# EAGLE design CurrentSensorAC712-30_multi (EAGLE 9.6.2)
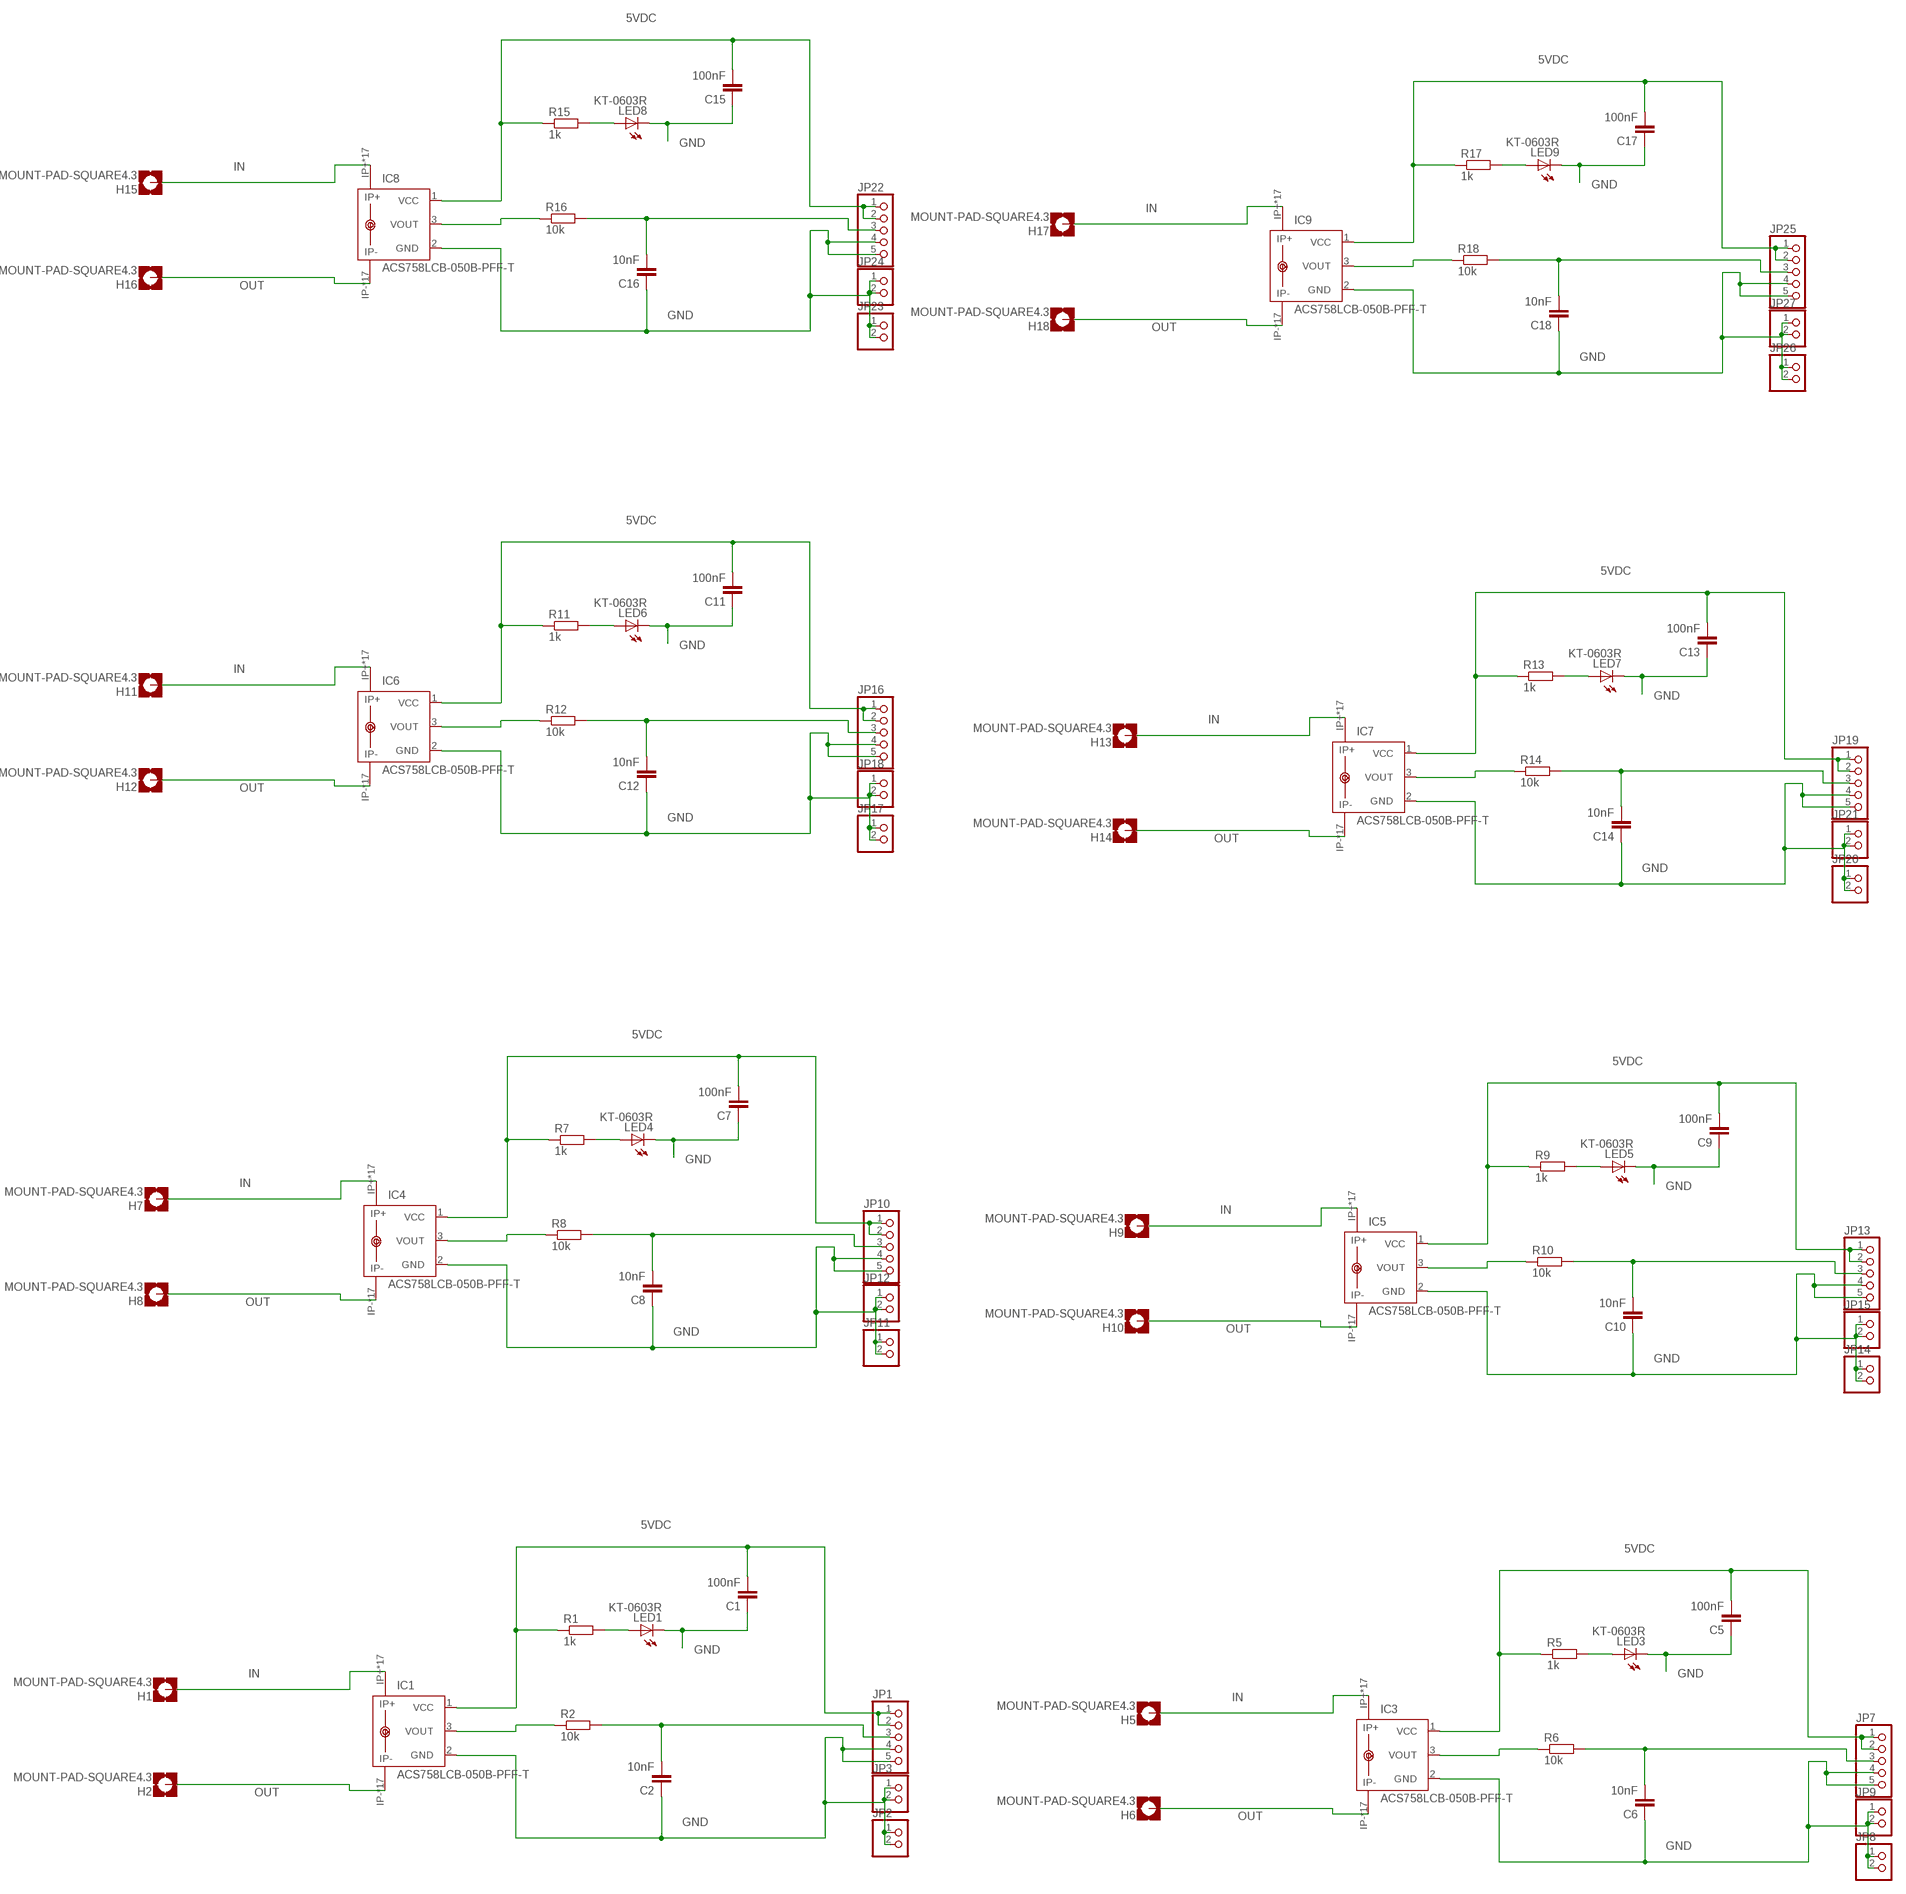
[diagram p0: schematic, sheet 1]

## Parts
C1  100nF  C-EUC0805  [C0805]
C2  10nF  C-EUC0805  [C0805]
C5  100nF  C-EUC0805  [C0805]
C6  10nF  C-EUC0805  [C0805]
C7  100nF  C-EUC0805  [C0805]
C8  10nF  C-EUC0805  [C0805]
C9  100nF  C-EUC0805  [C0805]
C10  10nF  C-EUC0805  [C0805]
C11  100nF  C-EUC0805  [C0805]
C12  10nF  C-EUC0805  [C0805]
C13  100nF  C-EUC0805  [C0805]
C14  10nF  C-EUC0805  [C0805]
C15  100nF  C-EUC0805  [C0805]
C16  10nF  C-EUC0805  [C0805]
C17  100nF  C-EUC0805  [C0805]
C18  10nF  C-EUC0805  [C0805]
H1  MOUNT-PAD-SQUARE4.3  [4,3-PAD-SQUARE]
H2  MOUNT-PAD-SQUARE4.3  [4,3-PAD-SQUARE]
H5  MOUNT-PAD-SQUARE4.3  [4,3-PAD-SQUARE]
H6  MOUNT-PAD-SQUARE4.3  [4,3-PAD-SQUARE]
H7  MOUNT-PAD-SQUARE4.3  [4,3-PAD-SQUARE]
H8  MOUNT-PAD-SQUARE4.3  [4,3-PAD-SQUARE]
H9  MOUNT-PAD-SQUARE4.3  [4,3-PAD-SQUARE]
H10  MOUNT-PAD-SQUARE4.3  [4,3-PAD-SQUARE]
H11  MOUNT-PAD-SQUARE4.3  [4,3-PAD-SQUARE]
H12  MOUNT-PAD-SQUARE4.3  [4,3-PAD-SQUARE]
H13  MOUNT-PAD-SQUARE4.3  [4,3-PAD-SQUARE]
H14  MOUNT-PAD-SQUARE4.3  [4,3-PAD-SQUARE]
H15  MOUNT-PAD-SQUARE4.3  [4,3-PAD-SQUARE]
H16  MOUNT-PAD-SQUARE4.3  [4,3-PAD-SQUARE]
H17  MOUNT-PAD-SQUARE4.3  [4,3-PAD-SQUARE]
H18  MOUNT-PAD-SQUARE4.3  [4,3-PAD-SQUARE]
IC1  ACS758LCB-050B-PFF-T  [CB-PFF]
IC3  ACS758LCB-050B-PFF-T  [CB-PFF]
IC4  ACS758LCB-050B-PFF-T  [CB-PFF]
IC5  ACS758LCB-050B-PFF-T  [CB-PFF]
IC6  ACS758LCB-050B-PFF-T  [CB-PFF]
IC7  ACS758LCB-050B-PFF-T  [CB-PFF]
IC8  ACS758LCB-050B-PFF-T  [CB-PFF]
IC9  ACS758LCB-050B-PFF-T  [CB-PFF]
JP1  PINHD-1X5  [1X05]
JP2  PINHD-1X2  [1X02]
JP3  PINHD-1X2  [1X02]
JP7  PINHD-1X5  [1X05]
JP8  PINHD-1X2  [1X02]
JP9  PINHD-1X2  [1X02]
JP10  PINHD-1X5  [1X05]
JP11  PINHD-1X2  [1X02]
JP12  PINHD-1X2  [1X02]
JP13  PINHD-1X5  [1X05]
JP14  PINHD-1X2  [1X02]
JP15  PINHD-1X2  [1X02]
JP16  PINHD-1X5  [1X05]
JP17  PINHD-1X2  [1X02]
JP18  PINHD-1X2  [1X02]
JP19  PINHD-1X5  [1X05]
JP20  PINHD-1X2  [1X02]
JP21  PINHD-1X2  [1X02]
JP22  PINHD-1X5  [1X05]
JP23  PINHD-1X2  [1X02]
JP24  PINHD-1X2  [1X02]
JP25  PINHD-1X5  [1X05]
JP26  PINHD-1X2  [1X02]
JP27  PINHD-1X2  [1X02]
LED1  KT-0603R  LEDCHIPLED_0603  [CHIPLED_0603]
LED3  KT-0603R  LEDCHIPLED_0603  [CHIPLED_0603]
LED4  KT-0603R  LEDCHIPLED_0603  [CHIPLED_0603]
LED5  KT-0603R  LEDCHIPLED_0603  [CHIPLED_0603]
LED6  KT-0603R  LEDCHIPLED_0603  [CHIPLED_0603]
LED7  KT-0603R  LEDCHIPLED_0603  [CHIPLED_0603]
LED8  KT-0603R  LEDCHIPLED_0603  [CHIPLED_0603]
LED9  KT-0603R  LEDCHIPLED_0603  [CHIPLED_0603]
R1  1k  R-EU_R0805  [R0805]
R2  10k  R-EU_R0805  [R0805]
R5  1k  R-EU_R0805  [R0805]
R6  10k  R-EU_R0805  [R0805]
R7  1k  R-EU_R0805  [R0805]
R8  10k  R-EU_R0805  [R0805]
R9  1k  R-EU_R0805  [R0805]
R10  10k  R-EU_R0805  [R0805]
R11  1k  R-EU_R0805  [R0805]
R12  10k  R-EU_R0805  [R0805]
R13  1k  R-EU_R0805  [R0805]
R14  10k  R-EU_R0805  [R0805]
R15  1k  R-EU_R0805  [R0805]
R16  10k  R-EU_R0805  [R0805]
R17  1k  R-EU_R0805  [R0805]
R18  10k  R-EU_R0805  [R0805]

## Nets
5VDC: C1.2 C5.2 C7.2 C9.2 C11.2 C13.2 C15.2 C17.2 IC1.1(VCC) IC3.1(VCC) IC4.1(VCC) IC5.1(VCC) IC6.1(VCC) IC7.1(VCC) IC8.1(VCC) IC9.1(VCC) JP1.1 JP1.2 JP7.1 JP7.2 JP10.1 JP10.2 JP13.1 JP13.2 JP16.1 JP16.2 JP19.1 JP19.2 JP22.1 JP22.2 JP25.1 JP25.2 R1.1 R5.1 R7.1 R9.1 R11.1 R13.1 R15.1 R17.1
GND: C1.1 C2.1 C5.1 C6.1 C7.1 C8.1 C9.1 C10.1 C11.1 C12.1 C13.1 C14.1 C15.1 C16.1 C17.1 C18.1 IC1.2(GND) IC3.2(GND) IC4.2(GND) IC5.2(GND) IC6.2(GND) IC7.2(GND) IC8.2(GND) IC9.2(GND) JP1.4 JP1.5 JP2.1 JP2.2 JP3.1 JP3.2 JP7.4 JP7.5 JP8.1 JP8.2 JP9.1 JP9.2 JP10.4 JP10.5 JP11.1 JP11.2 JP12.1 JP12.2 JP13.4 JP13.5 JP14.1 JP14.2 JP15.1 JP15.2 JP16.4 JP16.5 JP17.1 JP17.2 JP18.1 JP18.2 JP19.4 JP19.5 JP20.1 JP20.2 JP21.1 JP21.2 JP22.4 JP22.5 JP23.1 JP23.2 JP24.1 JP24.2 JP25.4 JP25.5 JP26.1 JP26.2 JP27.1 JP27.2 LED1.C LED3.C LED4.C LED5.C LED6.C LED7.C LED8.C LED9.C
IN: H1.B4,3(MOUNT) H5.B4,3(MOUNT) H7.B4,3(MOUNT) H9.B4,3(MOUNT) H11.B4,3(MOUNT) H13.B4,3(MOUNT) H15.B4,3(MOUNT) H17.B4,3(MOUNT) IC1.IP+ IC1.IP+@2(IP+) IC1.IP+@3(IP+) IC1.IP+@4(IP+) IC1.IP+@5(IP+) IC1.IP+@6(IP+) IC1.IP+@7(IP+) IC1.IP+@8(IP+) IC1.IP+@9(IP+) IC1.IP+@10(IP+) IC1.IP+@11(IP+) IC1.IP+@12(IP+) IC1.IP+@13(IP+) IC1.IP+@14(IP+) IC1.IP+@15(IP+) IC1.IP+@16(IP+) IC1.IP+@17(IP+) IC3.IP+ IC3.IP+@2(IP+) IC3.IP+@3(IP+) IC3.IP+@4(IP+) IC3.IP+@5(IP+) IC3.IP+@6(IP+) IC3.IP+@7(IP+) IC3.IP+@8(IP+) IC3.IP+@9(IP+) IC3.IP+@10(IP+) IC3.IP+@11(IP+) IC3.IP+@12(IP+) IC3.IP+@13(IP+) IC3.IP+@14(IP+) IC3.IP+@15(IP+) IC3.IP+@16(IP+) IC3.IP+@17(IP+) IC4.IP+ IC4.IP+@2(IP+) IC4.IP+@3(IP+) IC4.IP+@4(IP+) IC4.IP+@5(IP+) IC4.IP+@6(IP+) IC4.IP+@7(IP+) IC4.IP+@8(IP+) IC4.IP+@9(IP+) IC4.IP+@10(IP+) IC4.IP+@11(IP+) IC4.IP+@12(IP+) IC4.IP+@13(IP+) IC4.IP+@14(IP+) IC4.IP+@15(IP+) IC4.IP+@16(IP+) IC4.IP+@17(IP+) IC5.IP+ IC5.IP+@2(IP+) IC5.IP+@3(IP+) IC5.IP+@4(IP+) IC5.IP+@5(IP+) IC5.IP+@6(IP+) IC5.IP+@7(IP+) IC5.IP+@8(IP+) IC5.IP+@9(IP+) IC5.IP+@10(IP+) IC5.IP+@11(IP+) IC5.IP+@12(IP+) IC5.IP+@13(IP+) IC5.IP+@14(IP+) IC5.IP+@15(IP+) IC5.IP+@16(IP+) IC5.IP+@17(IP+) IC6.IP+ IC6.IP+@2(IP+) IC6.IP+@3(IP+) IC6.IP+@4(IP+) IC6.IP+@5(IP+) IC6.IP+@6(IP+) IC6.IP+@7(IP+) IC6.IP+@8(IP+) IC6.IP+@9(IP+) IC6.IP+@10(IP+) IC6.IP+@11(IP+) IC6.IP+@12(IP+) IC6.IP+@13(IP+) IC6.IP+@14(IP+) IC6.IP+@15(IP+) IC6.IP+@16(IP+) IC6.IP+@17(IP+) IC7.IP+ IC7.IP+@2(IP+) IC7.IP+@3(IP+) IC7.IP+@4(IP+) IC7.IP+@5(IP+) IC7.IP+@6(IP+) IC7.IP+@7(IP+) IC7.IP+@8(IP+) IC7.IP+@9(IP+) IC7.IP+@10(IP+) IC7.IP+@11(IP+) IC7.IP+@12(IP+) IC7.IP+@13(IP+) IC7.IP+@14(IP+) IC7.IP+@15(IP+) IC7.IP+@16(IP+) IC7.IP+@17(IP+) IC8.IP+ IC8.IP+@2(IP+) IC8.IP+@3(IP+) IC8.IP+@4(IP+) IC8.IP+@5(IP+) IC8.IP+@6(IP+) IC8.IP+@7(IP+) IC8.IP+@8(IP+) IC8.IP+@9(IP+) IC8.IP+@10(IP+) IC8.IP+@11(IP+) IC8.IP+@12(IP+) IC8.IP+@13(IP+) IC8.IP+@14(IP+) IC8.IP+@15(IP+) IC8.IP+@16(IP+) IC8.IP+@17(IP+) IC9.IP+ IC9.IP+@2(IP+) IC9.IP+@3(IP+) IC9.IP+@4(IP+) IC9.IP+@5(IP+) IC9.IP+@6(IP+) IC9.IP+@7(IP+) IC9.IP+@8(IP+) IC9.IP+@9(IP+) IC9.IP+@10(IP+) IC9.IP+@11(IP+) IC9.IP+@12(IP+) IC9.IP+@13(IP+) IC9.IP+@14(IP+) IC9.IP+@15(IP+) IC9.IP+@16(IP+) IC9.IP+@17(IP+)
N$1: IC1.3(VOUT) R2.1
N$5: LED1.A R1.2
N$6: C2.2 JP1.3 R2.2
N$7: LED3.A R5.2
N$8: C6.2 JP7.3 R6.2
N$9: IC3.3(VOUT) R6.1
N$10: LED4.A R7.2
N$11: C8.2 JP10.3 R8.2
N$12: IC4.3(VOUT) R8.1
N$13: LED5.A R9.2
N$14: C10.2 JP13.3 R10.2
N$15: IC5.3(VOUT) R10.1
N$16: LED6.A R11.2
N$17: C12.2 JP16.3 R12.2
N$18: IC6.3(VOUT) R12.1
N$19: LED7.A R13.2
N$20: C14.2 JP19.3 R14.2
N$21: IC7.3(VOUT) R14.1
N$22: LED8.A R15.2
N$23: C16.2 JP22.3 R16.2
N$24: IC8.3(VOUT) R16.1
N$25: LED9.A R17.2
N$26: C18.2 JP25.3 R18.2
N$27: IC9.3(VOUT) R18.1
OUT: H2.B4,3(MOUNT) H6.B4,3(MOUNT) H8.B4,3(MOUNT) H10.B4,3(MOUNT) H12.B4,3(MOUNT) H14.B4,3(MOUNT) H16.B4,3(MOUNT) H18.B4,3(MOUNT) IC1.IP- IC1.IP-@2(IP-) IC1.IP-@3(IP-) IC1.IP-@4(IP-) IC1.IP-@5(IP-) IC1.IP-@6(IP-) IC1.IP-@7(IP-) IC1.IP-@8(IP-) IC1.IP-@9(IP-) IC1.IP-@10(IP-) IC1.IP-@11(IP-) IC1.IP-@12(IP-) IC1.IP-@13(IP-) IC1.IP-@14(IP-) IC1.IP-@15(IP-) IC1.IP-@16(IP-) IC1.IP-@17(IP-) IC3.IP- IC3.IP-@2(IP-) IC3.IP-@3(IP-) IC3.IP-@4(IP-) IC3.IP-@5(IP-) IC3.IP-@6(IP-) IC3.IP-@7(IP-) IC3.IP-@8(IP-) IC3.IP-@9(IP-) IC3.IP-@10(IP-) IC3.IP-@11(IP-) IC3.IP-@12(IP-) IC3.IP-@13(IP-) IC3.IP-@14(IP-) IC3.IP-@15(IP-) IC3.IP-@16(IP-) IC3.IP-@17(IP-) IC4.IP- IC4.IP-@2(IP-) IC4.IP-@3(IP-) IC4.IP-@4(IP-) IC4.IP-@5(IP-) IC4.IP-@6(IP-) IC4.IP-@7(IP-) IC4.IP-@8(IP-) IC4.IP-@9(IP-) IC4.IP-@10(IP-) IC4.IP-@11(IP-) IC4.IP-@12(IP-) IC4.IP-@13(IP-) IC4.IP-@14(IP-) IC4.IP-@15(IP-) IC4.IP-@16(IP-) IC4.IP-@17(IP-) IC5.IP- IC5.IP-@2(IP-) IC5.IP-@3(IP-) IC5.IP-@4(IP-) IC5.IP-@5(IP-) IC5.IP-@6(IP-) IC5.IP-@7(IP-) IC5.IP-@8(IP-) IC5.IP-@9(IP-) IC5.IP-@10(IP-) IC5.IP-@11(IP-) IC5.IP-@12(IP-) IC5.IP-@13(IP-) IC5.IP-@14(IP-) IC5.IP-@15(IP-) IC5.IP-@16(IP-) IC5.IP-@17(IP-) IC6.IP- IC6.IP-@2(IP-) IC6.IP-@3(IP-) IC6.IP-@4(IP-) IC6.IP-@5(IP-) IC6.IP-@6(IP-) IC6.IP-@7(IP-) IC6.IP-@8(IP-) IC6.IP-@9(IP-) IC6.IP-@10(IP-) IC6.IP-@11(IP-) IC6.IP-@12(IP-) IC6.IP-@13(IP-) IC6.IP-@14(IP-) IC6.IP-@15(IP-) IC6.IP-@16(IP-) IC6.IP-@17(IP-) IC7.IP- IC7.IP-@2(IP-) IC7.IP-@3(IP-) IC7.IP-@4(IP-) IC7.IP-@5(IP-) IC7.IP-@6(IP-) IC7.IP-@7(IP-) IC7.IP-@8(IP-) IC7.IP-@9(IP-) IC7.IP-@10(IP-) IC7.IP-@11(IP-) IC7.IP-@12(IP-) IC7.IP-@13(IP-) IC7.IP-@14(IP-) IC7.IP-@15(IP-) IC7.IP-@16(IP-) IC7.IP-@17(IP-) IC8.IP- IC8.IP-@2(IP-) IC8.IP-@3(IP-) IC8.IP-@4(IP-) IC8.IP-@5(IP-) IC8.IP-@6(IP-) IC8.IP-@7(IP-) IC8.IP-@8(IP-) IC8.IP-@9(IP-) IC8.IP-@10(IP-) IC8.IP-@11(IP-) IC8.IP-@12(IP-) IC8.IP-@13(IP-) IC8.IP-@14(IP-) IC8.IP-@15(IP-) IC8.IP-@16(IP-) IC8.IP-@17(IP-) IC9.IP- IC9.IP-@2(IP-) IC9.IP-@3(IP-) IC9.IP-@4(IP-) IC9.IP-@5(IP-) IC9.IP-@6(IP-) IC9.IP-@7(IP-) IC9.IP-@8(IP-) IC9.IP-@9(IP-) IC9.IP-@10(IP-) IC9.IP-@11(IP-) IC9.IP-@12(IP-) IC9.IP-@13(IP-) IC9.IP-@14(IP-) IC9.IP-@15(IP-) IC9.IP-@16(IP-) IC9.IP-@17(IP-)

## Library data of the parts
C1 C2 C5-C18 = rcl:C-EU: CAPACITOR, European symbol
H1 H2 H5-H18 = holes:MOUNT-PAD-SQUARE: MOUNTING PAD, square
IC1 IC3-IC9 = allegro-2:ACS758*: Thermally Enhanced, Fully Integrated, Hall Effect-Based Linear Current Sensor with 100 micro Ohm Current Conductor display layer 49 Reference in BRD and place VIAs on circles Source: http://www.allegromicro.com/en/Products/Part_Numbers/0758/0758.pdf; MPN: ACS758LCB-050B-PFF-T; OC_FARNELL: 1718997; OC_NEWARK: 04R7131
JP1 JP7 JP10 JP13 JP16 JP19 JP22 JP25 = pinhead:PINHD-1X5: PIN HEADER
JP2 JP3 JP8 JP9 JP11 JP12 JP14 JP15 JP17 JP18 JP20 JP21 JP23 JP24 JP26 JP27 = pinhead:PINHD-1X2: PIN HEADER
LED1 LED3-LED9 = led:LED: LED OSRAM: - CHIPLED LG R971, LG N971, LY N971, LG Q971, LY Q971, LO R971, LY R971 LH N974, LH R974 LS Q976, LO Q976, LY Q976 LO Q996 - Hyper CHIPLED LW Q18S LB Q993, LB Q99A, LB R99A - SideLED LS A670, LO A670, LY A670, LG A670, LP A670 LB A673, LV A673, LT A673, LW A673 LH A674 LY A675 LS A676, LA A676, LO A676, LY A676, LW A676 LS A679, LY A679, LG A679 - Hyper Micro SIDELED® LS Y876, LA Y876, LO Y876, LY Y876 LT Y87S - SmartLED LW L88C, LW L88S LB L89C, LB L89S, LG L890 LS L89K, LO L89K, LY L89K LS L896, LA L896, LO L896, LY L896 - TOPLED LS T670, LO T670, LY T670, LG T670, LP T670 LSG T670, LSP T670, LSY T670, LOP T670, LYG T670 LG T671, LOG T671, LSG T671 LB T673, LV T673, LT T673, LW T673 LH T674 LS T676, LA T676, LO T676, LY T676, LB T676, LH T676, LSB T676, LW T676 LB T67C, LV T67C, LT T67C, LS T67K, LO T67K, LY T67K, LW E67C LS E67B, LA E67B, LO E67B, LY E67B, LB E67C, LV E67C, LT E67C LW T67C LS T679, LY T679, LG T679 LS T770, LO T770, LY T770, LG T770, LP T770 LB T773, LV T773, LT T773, LW T773 LH T774 LS E675, LA E675, LY E675, LS T675 LS T776, LA T776, LO T776, LY T776, LB T776 LHGB T686 LT T68C, LB T68C - Hyper Mini TOPLED® LB M676 - Mini TOPLED Santana® LG M470 LS M47K, LO M47K, LY M47K Source: http://www.osram.convergy.de LUXEON: - LUMILED® LXK2-PW12-R00, LXK2-PW12-S00, LXK2-PW14-U00, LXK2-PW14-V00 LXK2-PM12-R00, LXK2-PM12-S00, LXK2-PM14-U00 LXK2-PE12-Q00, LXK2-PE12-R00, LXK2-PE12-S00, LXK2-PE14-T00, LXK2-PE14-U00 LXK2-PB12-K00, LXK2-PB12-L00, LXK2-PB12-M00, LXK2-PB14-N00, LXK2-PB14-P00, LXK2-PB14-Q00 LXK2-PR12-L00, LXK2-PR12-M00, LXK2-PR14-Q00, LXK2-PR14-R00 LXK2-PD12-Q00, LXK2-PD12-R00, LXK2-PD12-S00 LXK2-PH12-R00, LXK2-PH12-S00 LXK2-PL12-P00, LXK2-PL12-Q00, LXK2-PL12-R00 Source: www.luxeon.com KINGBRIGHT: KA-3528ASYC Source: www.kingbright.com
R1 R2 R5-R18 = rcl:R-EU_: RESISTOR, European symbol

## Board
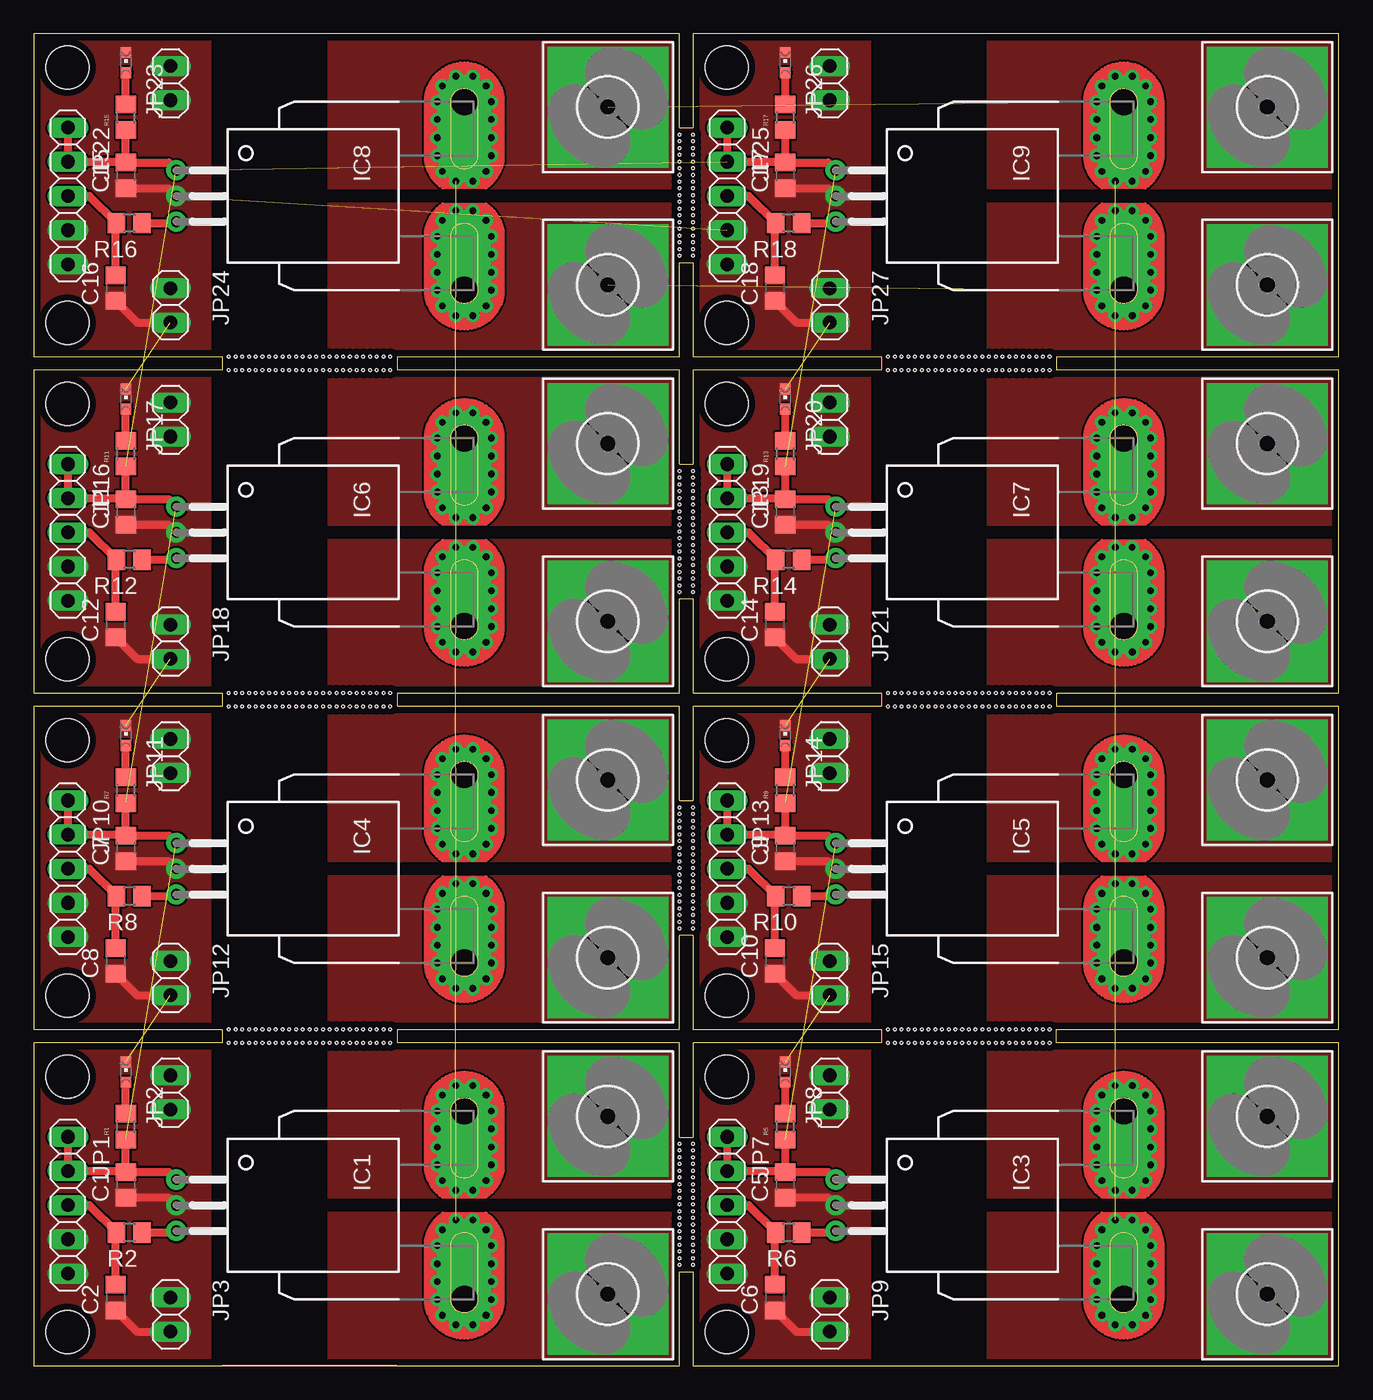
[diagram p1: board, top side]
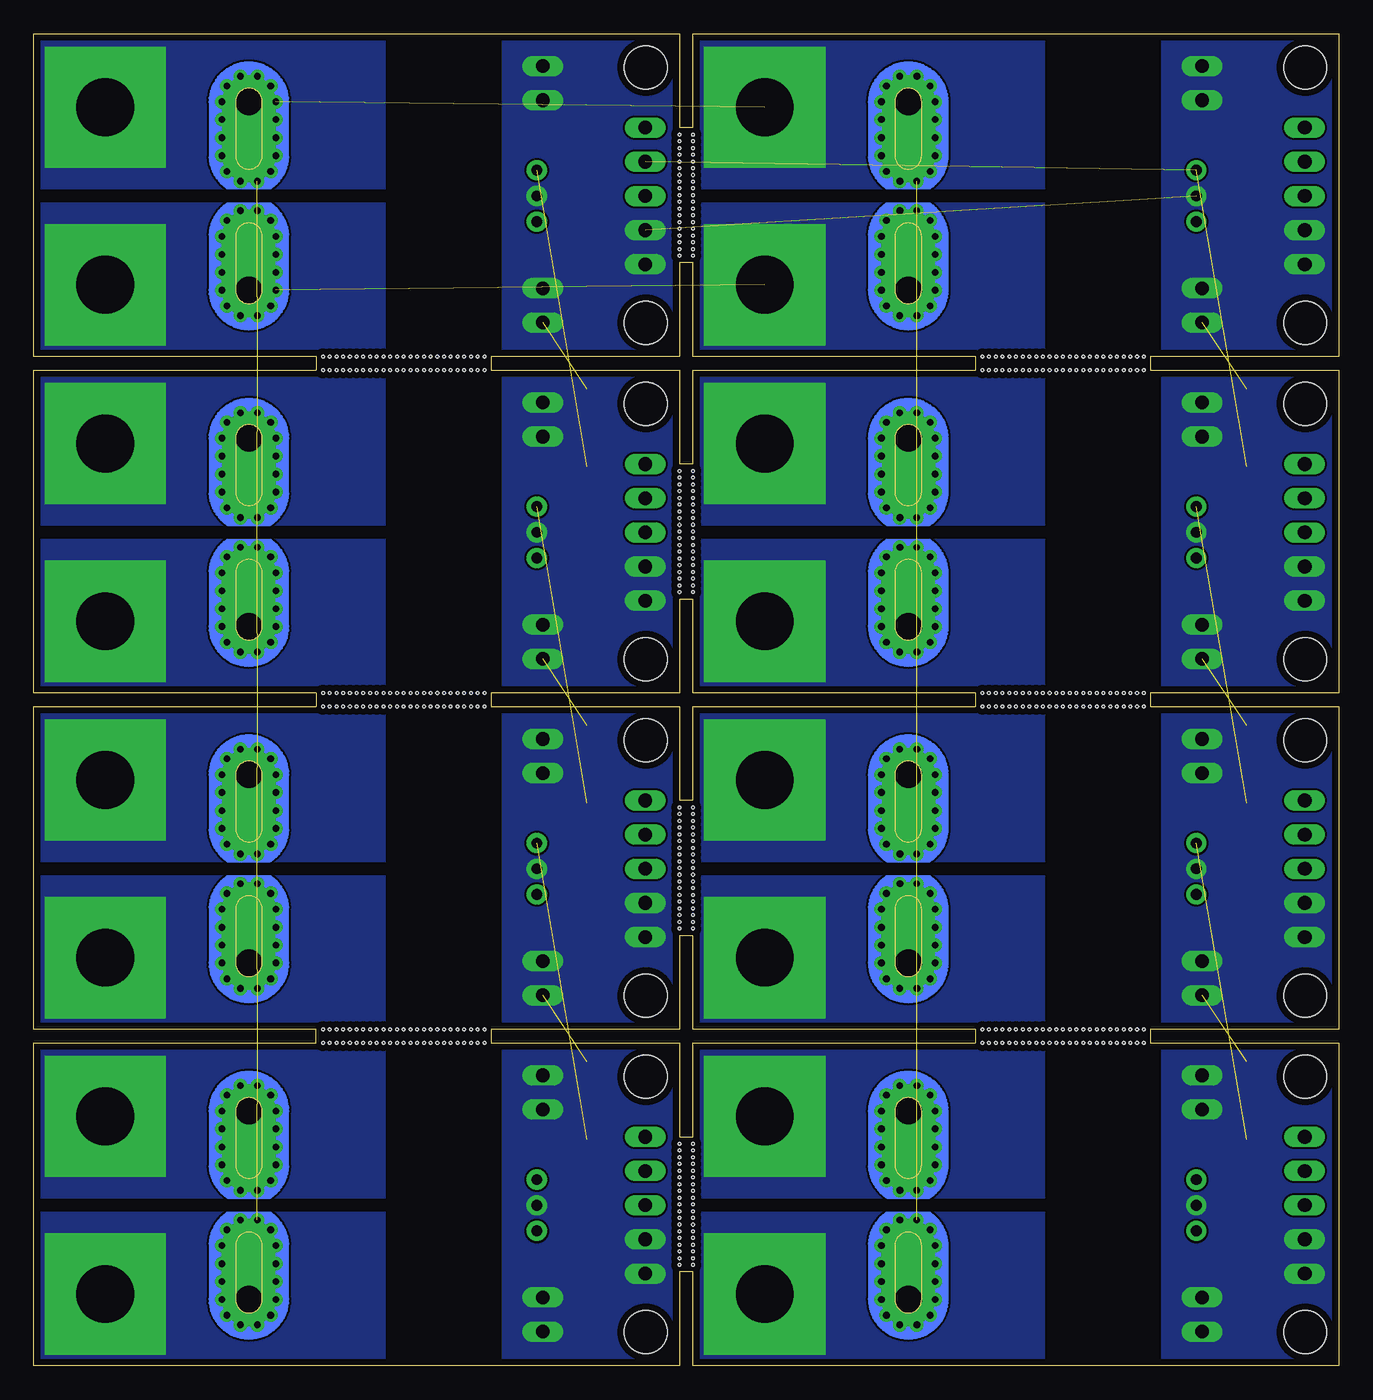
[diagram p2: board, bottom side, seen from below]

Size 97 x 99 mm. Coordinates in mm from the lower left corner, seen from the top.
Outline: 0,0 48,0 48,7 49,7 49,0 97,0 97,24 76,24 76,25 97,25 97,49 76,49 76,50 97,50 97,74 76,74 76,75 97,75 97,99 49,99 49,92 48,92 48,99 0,99 0,75 14,75 14,74 0,74 0,50 14,50 14,49 0,49 0,25 14,25 14,24 0,24 0,0
Outline: 48,17 48,24 27,24 27,25 48,25 48,32 49,32 49,25 63,25 63,24 49,24 49,17 48,17
Outline: 48,42 48,49 27,49 27,50 48,50 48,57 49,57 49,50 63,50 63,49 49,49 49,42 48,42
Outline: 48,67 48,74 27,74 27,75 48,75 48,82 49,82 49,75 63,75 63,74 49,74 49,67 48,67
Copper layers (1*16): Top 0.035mm / dielectric 1.5mm / Bottom 0.035mm
Design rules "default *": minimum track width 6mil, minimum drill 0.35mm, track to track 6mil, track to pad 6mil, pad to pad 6mil, via to via 6mil, smd to smd 6mil, copper to edge 20mil, drill to drill 6mil, minimum pad ring 10mil, minimum via ring 8mil, stop-mask expansion 4mil, vias tented up to drill 0mil, thermal gap 10mil
Holes 3.2 mm at 2.5,21.5 2.5,2.5 51.5,21.5 51.5,2.5 2.5,46.5 2.5,27.5 51.5,46.5 51.5,27.5 2.5,71.5 2.5,52.5 51.5,71.5 51.5,52.5 2.5,96.5 2.5,77.5 51.5,96.5 51.5,77.5
Holes 0.2 mm at 14.5,75 14.5,74 15,74 15.5,74 16,74 16.5,74 17.5,74 17,74 18,74 18.5,74 19,74 19.5,74 20,74 20.5,74 21,74 21.5,74 22,74 23,74 22.5,74 23.5,74 24,74 24.5,74 25.5,74 26,74 25,74 26.5,74 26.5,75 26,75 25.5,75 25,75 24.5,75 24,75 23.5,75 23,75 22.5,75 22,75 21.5,75 21,75 20.5,75 20,75 19.5,75 19,75 18.5,75 18,75 17.5,75 17,75 16.5,75 16,75 15.5,75 15,75 63.5,75 63.5,74 64,74 64.5,74 65,74 65.5,74 66.5,74 66,74 67,74 67.5,74 68,74 68.5,74 69,74 69.5,74 70,74 70.5,74 71,74 72,74 71.5,74 72.5,74 73,74 73.5,74 74.5,74 75,74 74,74 75.5,74 75.5,75 75,75 74.5,75 74,75 73.5,75 73,75 72.5,75 72,75 71.5,75 71,75 70.5,75 70,75 69.5,75 69,75 68.5,75 68,75 67.5,75 67,75 66.5,75 66,75 65.5,75 65,75 64.5,75 64,75 63.5,50 63.5,49 64,49 64.5,49 65,49 65.5,49 66.5,49 66,49 67,49 67.5,49 68,49 68.5,49 69,49 69.5,49 70,49 70.5,49 71,49 72,49 71.5,49 72.5,49 73,49 73.5,49 74.5,49 75,49 74,49 75.5,49 75.5,50 75,50 74.5,50 74,50 73.5,50 73,50 72.5,50 72,50 71.5,50 71,50 70.5,50 70,50 69.5,50 69,50 68.5,50 68,50 67.5,50 67,50 66.5,50 66,50 65.5,50 65,50 64.5,50 64,50 14.5,50 14.5,49 15,49 15.5,49 16,49 16.5,49 17.5,49 17,49 18,49 18.5,49 19,49 19.5,49 20,49 20.5,49 21,49 21.5,49 22,49 23,49 22.5,49 23.5,49 24,49 24.5,49 25.5,49 26,49 25,49 26.5,49 26.5,50 26,50 25.5,50 25,50 24.5,50 24,50 23.5,50 23,50 22.5,50 22,50 21.5,50 21,50 20.5,50 20,50 19.5,50 19,50 18.5,50 18,50 17.5,50 17,50 16.5,50 16,50 15.5,50 15,50 14.5,25 14.5,24 15,24 15.5,24 16,24 16.5,24 17.5,24 17,24 18,24 18.5,24 19,24 19.5,24 20,24 20.5,24 21,24 21.5,24 22,24 23,24 22.5,24 23.5,24 24,24 24.5,24 25.5,24 26,24 25,24 26.5,24 26.5,25 26,25 25.5,25 25,25 24.5,25 24,25 23.5,25 23,25 22.5,25 22,25 21.5,25 21,25 20.5,25 20,25 19.5,25 19,25 18.5,25 18,25 17.5,25 17,25 16.5,25 16,25 15.5,25 15,25 63.5,25 63.5,24 64,24 64.5,24 65,24 65.5,24 66.5,24 66,24 67,24 67.5,24 68,24 68.5,24 69,24 69.5,24 70,24 70.5,24 71,24 72,24 71.5,24 72.5,24 73,24 73.5,24 74.5,24 75,24 74,24 75.5,24 75.5,25 75,25 74.5,25 74,25 73.5,25 73,25 72.5,25 72,25 71.5,25 71,25 70.5,25 70,25 69.5,25 69,25 68.5,25 68,25 67.5,25 67,25 66.5,25 66,25 65.5,25 65,25 64.5,25 64,25 48,7.5 49,7.5 49,8 48,8 48,8.5 49,8.5 49,9 48,9 48,9.5 49,9.5 49,10 49,10.5 49,11 49,11.5 49,12 49,12.5 49,13 49,13.5 49,14 49,15 49,14.5 49,15.5 49,16 49,16.5 48,16.5 48,16 48,15.5 48,15 48,14.5 48,14 48,13.5 48,13 48,12.5 48,12 48,11.5 48,11 48,10.5 48,10 48,32.5 49,32.5 49,33 48,33 48,33.5 49,33.5 49,34 48,34 48,34.5 49,34.5 49,35 49,35.5 49,36 49,36.5 49,37 49,37.5 49,38 49,38.5 49,39 49,40 49,39.5 49,40.5 49,41 49,41.5 48,41.5 48,41 48,40.5 48,40 48,39.5 48,39 48,38.5 48,38 48,37.5 48,37 48,36.5 48,36 48,35.5 48,35 48,57.5 49,57.5 49,58 48,58 48,58.5 49,58.5 49,59 48,59 48,59.5 49,59.5 49,60 49,60.5 49,61 49,61.5 49,62 49,62.5 49,63 49,63.5 49,64 49,65 49,64.5 49,65.5 49,66 49,66.5 48,66.5 48,66 48,65.5 48,65 48,64.5 48,64 48,63.5 48,63 48,62.5 48,62 48,61.5 48,61 48,60.5 48,60 48,82.5 49,82.5 49,83 48,83 48,83.5 49,83.5 49,84 48,84 48,84.5 49,84.5 49,85 49,85.5 49,86 49,86.5 49,87 49,87.5 49,88 49,88.5 49,89 49,90 49,89.5 49,90.5 49,91 49,91.5 48,91.5 48,91 48,90.5 48,90 48,89.5 48,89 48,88.5 48,88 48,87.5 48,87 48,86.5 48,86 48,85.5 48,85

### Footprints (pad centres in the part's own frame; a part is rotated, then mirrored left to right if it is on the bottom)
C0805 = smd 1.3 x 1.5: 1 -0.95,0; 2 0.95,0
4,3-PAD-SQUARE = drill 4.3 pad 9 square: B4,3 0,0
CB-PFF = drill 0.8 pad 1.5: 1 -1.91,-21.4; 2 0,-21.4; 3 1.91,-21.4 | drill 2 pad 4 offset: IP+ 7,0; IP- -7,0 | drill 0.5 pad 0.9: IP+@2 8.89,0.635; IP+@3 8.89,-0.635; IP+@4 8.175,-1.625; IP+@5 7,-2; IP+@6 5.675,-2; IP+@7 4.35,-2; IP+@8 3,-2; IP+@9 1.825,-1.625; IP+@10 1.1,-0.625; IP+@11 1.1,0.625; IP+@12 1.825,1.625; IP+@13 3,2; IP+@14 4.35,2; IP+@15 5.675,2; IP+@16 7,2; IP+@17 8.175,1.625; IP-@2 -8.89,0.635; IP-@3 -8.89,-0.635; IP-@4 -8.175,-1.625; IP-@5 -7,-2; IP-@6 -5.675,-2; IP-@7 -4.325,-2; IP-@8 -3,-2; IP-@9 -1.825,-1.625; IP-@10 -1.1,-0.625; IP-@11 -1.1,0.625; IP-@12 -1.825,1.625; IP-@13 -3,2; IP-@14 -4.325,2; IP-@15 -5.675,2; IP-@16 -7,2; IP-@17 -8.175,1.625
1X05 = drill 1.016 long: 1 -5.08,0; 2 -2.54,0; 3 0,0; 4 2.54,0; 5 5.08,0
1X02 = drill 1.016 long: 1 -1.27,0; 2 1.27,0
CHIPLED_0603 = smd 0.8 x 0.8: A 0,-0.75; C 0,0.75
R0805 = smd 1.3 x 1.5: 1 -0.95,0; 2 0.95,0

### Placement (x,y rotation side)
C1  6.86,13.46 90 top
C2  6.1,5.08 90 top
C5  55.86,13.46 90 top
C6  55.1,5.08 90 top
C7  6.86,38.46 90 top
C8  6.1,30.08 90 top
C9  55.86,38.46 90 top
C10  55.1,30.08 90 top
C11  6.86,63.46 90 top
C12  6.1,55.08 90 top
C13  55.86,63.46 90 top
C14  55.1,55.08 90 top
C15  6.86,88.46 90 top
C16  6.1,80.08 90 top
C17  55.86,88.46 90 top
C18  55.1,80.08 90 top
H1  42.67,5.33 0 top
H2  42.67,18.54 0 top
H5  91.67,5.33 0 top
H6  91.67,18.54 0 top
H7  42.67,30.33 0 top
H8  42.67,43.54 0 top
H9  91.67,30.33 0 top
H10  91.67,43.54 0 top
H11  42.67,55.33 0 top
H12  42.67,68.54 0 top
H13  91.67,55.33 0 top
H14  91.67,68.54 0 top
H15  42.67,80.33 0 top
H16  42.67,93.54 0 top
H17  91.67,80.33 0 top
H18  91.67,93.54 0 top
IC1  32,11.94 270 top
IC3  81,11.94 270 top
IC4  32,36.94 270 top
IC5  81,36.94 270 top
IC6  32,61.94 270 top
IC7  81,61.94 270 top
IC8  32,86.94 270 top
IC9  81,86.94 270 top
JP1  2.54,11.94 270 top
JP2  10.16,20.32 90 top
JP3  10.16,3.81 270 top
JP7  51.54,11.94 270 top
JP8  59.16,20.32 90 top
JP9  59.16,3.81 270 top
JP10  2.54,36.94 270 top
JP11  10.16,45.32 90 top
JP12  10.16,28.81 270 top
JP13  51.54,36.94 270 top
JP14  59.16,45.32 90 top
JP15  59.16,28.81 270 top
JP16  2.54,61.94 270 top
JP17  10.16,70.32 90 top
JP18  10.16,53.81 270 top
JP19  51.54,61.94 270 top
JP20  59.16,70.32 90 top
JP21  59.16,53.81 270 top
JP22  2.54,86.94 270 top
JP23  10.16,95.32 90 top
JP24  10.16,78.81 270 top
JP25  51.54,86.94 270 top
JP26  59.16,95.32 90 top
JP27  59.16,78.81 270 top
LED1  6.86,21.84 0 top
LED3  55.86,21.84 0 top
LED4  6.86,46.84 0 top
LED5  55.86,46.84 0 top
LED6  6.86,71.84 0 top
LED7  55.86,71.84 0 top
LED8  6.86,96.84 0 top
LED9  55.86,96.84 0 top
R1  6.86,17.78 90 top
R2  7.11,9.91 180 top
R5  55.86,17.78 90 top
R6  56.11,9.91 180 top
R7  6.86,42.78 90 top
R8  7.11,34.91 180 top
R9  55.86,42.78 90 top
R10  56.11,34.91 180 top
R11  6.86,67.78 90 top
R12  7.11,59.91 180 top
R13  55.86,67.78 90 top
R14  56.11,59.91 180 top
R15  6.86,92.78 90 top
R16  7.11,84.91 180 top
R17  55.86,92.78 90 top
R18  56.11,84.91 180 top

### Tracks (layer width: path | path; a pad name or v marks a point on that pad's centre or on a via)
5VDC  (7 unrouted)
  Top 0.61: C1.2 6.79,14.48 JP1.2 JP1.1 | C1.2 10.04,14.41 IC1.1 | C1.2 R1.1 | C5.2 55.79,14.48 JP7.2 JP7.1 | C5.2 59.04,14.41 IC3.1 | C5.2 R5.1 | C7.2 6.79,39.48 JP10.2 JP10.1 | C7.2 10.04,39.41 IC4.1 | C7.2 R7.1 | C9.2 55.79,39.48 JP13.2 JP13.1 | C9.2 59.04,39.41 IC5.1 | C9.2 R9.1 | C11.2 6.79,64.48 JP16.2 JP16.1 | C11.2 10.04,64.41 IC6.1 | C11.2 R11.1 | C13.2 55.79,64.48 JP19.2 JP19.1 | C13.2 59.04,64.41 IC7.1 | C13.2 R13.1 | C15.2 6.79,89.48 JP22.2 JP22.1 | C15.2 10.04,89.41 IC8.1 | C15.2 R15.1 | C17.2 55.79,89.48 JP25.2 JP25.1 | C17.2 59.04,89.41 IC9.1 | C17.2 R17.1
GND  (7 unrouted)
  Top 0.61: C1.1 10.03,12.51 IC1.2 | C2.1 7.69,2.54 JP3.2 | C5.1 59.03,12.51 IC3.2 | C6.1 56.69,2.54 JP9.2 | C7.1 10.03,37.51 IC4.2 | C8.1 7.69,27.54 JP12.2 | C9.1 59.03,37.51 IC5.2 | C10.1 56.69,27.54 JP15.2 | C11.1 10.03,62.51 IC6.2 | C12.1 7.69,52.54 JP18.2 | C13.1 59.03,62.51 IC7.2 | C14.1 56.69,52.54 JP21.2 | C15.1 10.03,87.51 IC8.2 | C16.1 7.69,77.54 JP24.2 | C17.1 59.03,87.51 IC9.2 | C18.1 56.69,77.54 JP27.2
  pour Top (no thermals): -1.02,24.64 13.21,24.64 13.21,-0.51 -1.02,-0.51
  pour Bottom (no thermals): -1.02,24.64 13.21,24.64 13.21,-0.51 -1.02,-0.51
  pour Top (no thermals): 48.98,24.64 62.21,24.64 62.21,-0.51 48.98,-0.51
  pour Bottom (no thermals): 48.98,24.64 62.21,24.64 62.21,-0.51 48.98,-0.51
  pour Top (no thermals): -1.02,49.64 13.21,49.64 13.21,24.49 -1.02,24.49
  pour Bottom (no thermals): -1.02,49.64 13.21,49.64 13.21,24.49 -1.02,24.49
  pour Top (no thermals): 47.98,49.64 62.21,49.64 62.21,24.49 47.98,24.49
  pour Bottom (no thermals): 47.98,49.64 62.21,49.64 62.21,24.49 47.98,24.49
  pour Top (no thermals): -1.02,74.64 13.21,74.64 13.21,49.49 -1.02,49.49
  pour Bottom (no thermals): -1.02,74.64 13.21,74.64 13.21,49.49 -1.02,49.49
  pour Top (no thermals): 47.98,74.64 62.21,74.64 62.21,49.49 47.98,49.49
  pour Bottom (no thermals): 47.98,74.64 62.21,74.64 62.21,49.49 47.98,49.49
  pour Top (no thermals): -1.02,99.64 13.21,99.64 13.21,74.49 -1.02,74.49
  pour Bottom (no thermals): -1.02,99.64 13.21,99.64 13.21,74.49 -1.02,74.49
  pour Top (no thermals): 47.98,99.64 62.21,99.64 62.21,74.49 47.98,74.49
  pour Bottom (no thermals): 47.98,99.64 62.21,99.64 62.21,74.49 47.98,74.49
IN  (7 unrouted)
  pour Top (no thermals): 21.84,11.43 48.51,11.43 48.51,-0.25 21.84,-0.25
  pour Bottom (no thermals): 21.84,11.43 48.26,11.43 48.26,-0.25 21.84,-0.25
  pour Top (no thermals): 70.84,11.43 97.51,11.43 97.51,-0.25 70.84,-0.25
  pour Bottom (no thermals): 70.84,11.43 97.26,11.43 97.26,-0.25 70.84,-0.25
  pour Top (no thermals): 21.84,36.43 48.51,36.43 48.51,24.75 21.84,24.75
  pour Bottom (no thermals): 21.84,36.43 48.26,36.43 48.26,24.75 21.84,24.75
  pour Top (no thermals): 70.84,36.43 97.51,36.43 97.51,24.75 70.84,24.75
  pour Bottom (no thermals): 70.84,36.43 97.26,36.43 97.26,24.75 70.84,24.75
  pour Top (no thermals): 21.84,61.43 48.51,61.43 48.51,49.75 21.84,49.75
  pour Bottom (no thermals): 21.84,61.43 48.26,61.43 48.26,49.75 21.84,49.75
  pour Top (no thermals): 70.84,61.43 97.51,61.43 97.51,49.75 70.84,49.75
  pour Bottom (no thermals): 70.84,61.43 97.26,61.43 97.26,49.75 70.84,49.75
  pour Top (no thermals): 21.84,86.43 48.51,86.43 48.51,74.75 21.84,74.75
  pour Bottom (no thermals): 21.84,86.43 48.26,86.43 48.26,74.75 21.84,74.75
  pour Top (no thermals): 70.84,86.43 97.51,86.43 97.51,74.75 70.84,74.75
  pour Bottom (no thermals): 70.84,86.43 97.26,86.43 97.26,74.75 70.84,74.75
N$1
  Top 0.61: R2.1 10.48,9.91 IC1.3
N$5
  Top 0.61: R1.2 LED1.A 6.98,21.09
N$6
  Top 0.61: JP1.3 4.13,11.94 R2.2 6.1,9.84 C2.2
N$7
  Top 0.61: R5.2 LED3.A 55.98,21.09
N$8
  Top 0.61: JP7.3 53.13,11.94 R6.2 55.1,9.84 C6.2
N$9
  Top 0.61: R6.1 59.48,9.91 IC3.3
N$10
  Top 0.61: R7.2 LED4.A 6.98,46.09
N$11
  Top 0.61: JP10.3 4.13,36.94 R8.2 6.1,34.84 C8.2
N$12
  Top 0.61: R8.1 10.48,34.91 IC4.3
N$13
  Top 0.61: R9.2 LED5.A 55.98,46.09
N$14
  Top 0.61: JP13.3 53.13,36.94 R10.2 55.1,34.84 C10.2
N$15
  Top 0.61: R10.1 59.48,34.91 IC5.3
N$16
  Top 0.61: R11.2 LED6.A 6.98,71.09
N$17
  Top 0.61: JP16.3 4.13,61.94 R12.2 6.1,59.84 C12.2
N$18
  Top 0.61: R12.1 10.48,59.91 IC6.3
N$19
  Top 0.61: R13.2 LED7.A 55.98,71.09
N$20
  Top 0.61: JP19.3 53.13,61.94 R14.2 55.1,59.84 C14.2
N$21
  Top 0.61: R14.1 59.48,59.91 IC7.3
N$22
  Top 0.61: R15.2 LED8.A 6.98,96.09
N$23
  Top 0.61: JP22.3 4.13,86.94 R16.2 6.1,84.84 C16.2
N$24
  Top 0.61: R16.1 10.48,84.91 IC8.3
N$25
  Top 0.61: R17.2 LED9.A 55.98,96.09
N$26
  Top 0.61: JP25.3 53.13,86.94 R18.2 55.1,84.84 C18.2
N$27
  Top 0.61: R18.1 59.48,84.91 IC9.3
OUT  (7 unrouted)
  pour Top (no thermals): 48.53,24.38 48.53,12.45 21.84,12.45 21.84,24.38
  pour Bottom (no thermals): 21.84,12.45 48.26,12.45 48.26,24.38 21.84,24.38
  pour Top (no thermals): 98.53,24.38 98.53,12.45 70.84,12.45 70.84,24.38
  pour Bottom (no thermals): 70.84,12.45 97.26,12.45 97.26,24.38 70.84,24.38
  pour Top (no thermals): 49.53,38.72 49.53,37.45 21.84,37.45 21.84,49.38 49.53,49.38
  pour Bottom (no thermals): 21.84,37.45 48.26,37.45 48.26,49.38 21.84,49.38
  pour Top (no thermals): 98.53,38.72 98.53,37.45 70.84,37.45 70.84,49.38 98.53,49.38
  pour Bottom (no thermals): 70.84,37.45 97.26,37.45 97.26,49.38 70.84,49.38
  pour Top (no thermals): 49.53,63.72 49.53,62.45 21.84,62.45 21.84,74.38 49.53,74.38
  pour Bottom (no thermals): 21.84,62.45 48.26,62.45 48.26,74.38 21.84,74.38
  pour Top (no thermals): 98.53,63.72 98.53,62.45 70.84,62.45 70.84,74.38 98.53,74.38
  pour Bottom (no thermals): 70.84,62.45 97.26,62.45 97.26,74.38 70.84,74.38
  pour Top (no thermals): 49.53,88.72 49.53,87.45 21.84,87.45 21.84,99.38 49.53,99.38
  pour Bottom (no thermals): 21.84,87.45 48.26,87.45 48.26,99.38 21.84,99.38
  pour Top (no thermals): 98.53,88.72 98.53,87.45 70.84,87.45 70.84,99.38 98.53,99.38
  pour Bottom (no thermals): 70.84,87.45 97.26,87.45 97.26,99.38 70.84,99.38